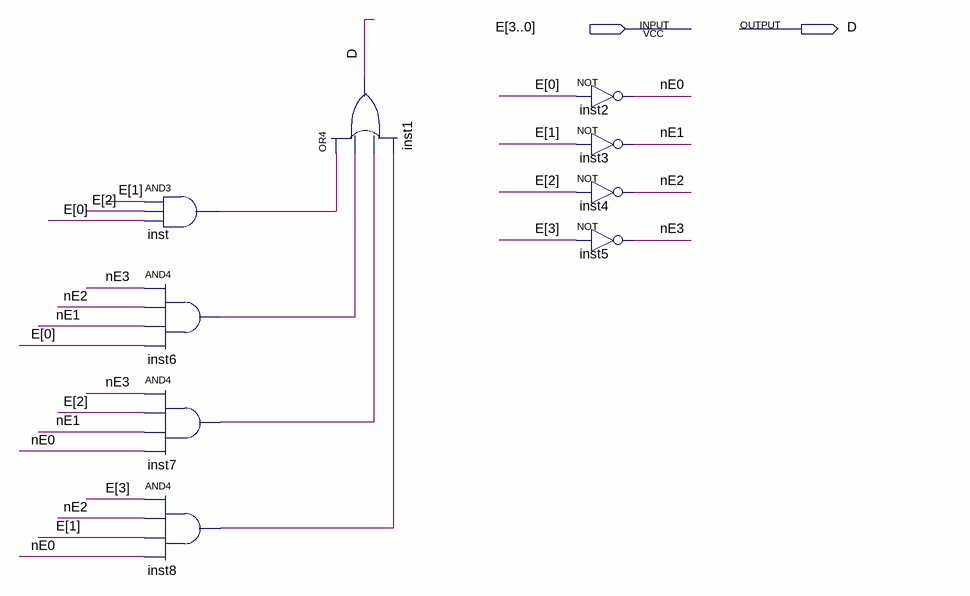
[diagram p0: schematic sheet]
// Quartus schematic displayD.bdf as structural Verilog: 9 symbols, 2 pins
module displayD (
  input  [3:0] E,
  output D
);

  wire inst6_out, inst7_out, inst8_out, inst_out, nE0, nE1, nE2, nE3;

  and inst (inst_out, E[1], E[2], E[0]);
  and inst6 (inst6_out, nE3, nE2, nE1, E[0]);
  and inst7 (inst7_out, nE3, E[2], nE1, nE0);
  and inst8 (inst8_out, E[3], nE2, E[1], nE0);
  or inst1 (D, inst_out, inst6_out, inst7_out, inst8_out);
  not inst2 (nE0, E[0]);
  not inst3 (nE1, E[1]);
  not inst4 (nE2, E[2]);
  not inst5 (nE3, E[3]);
endmodule
